# Altium schematic sheet EBI, GPIO.SchDoc
size 260 x 200 mm
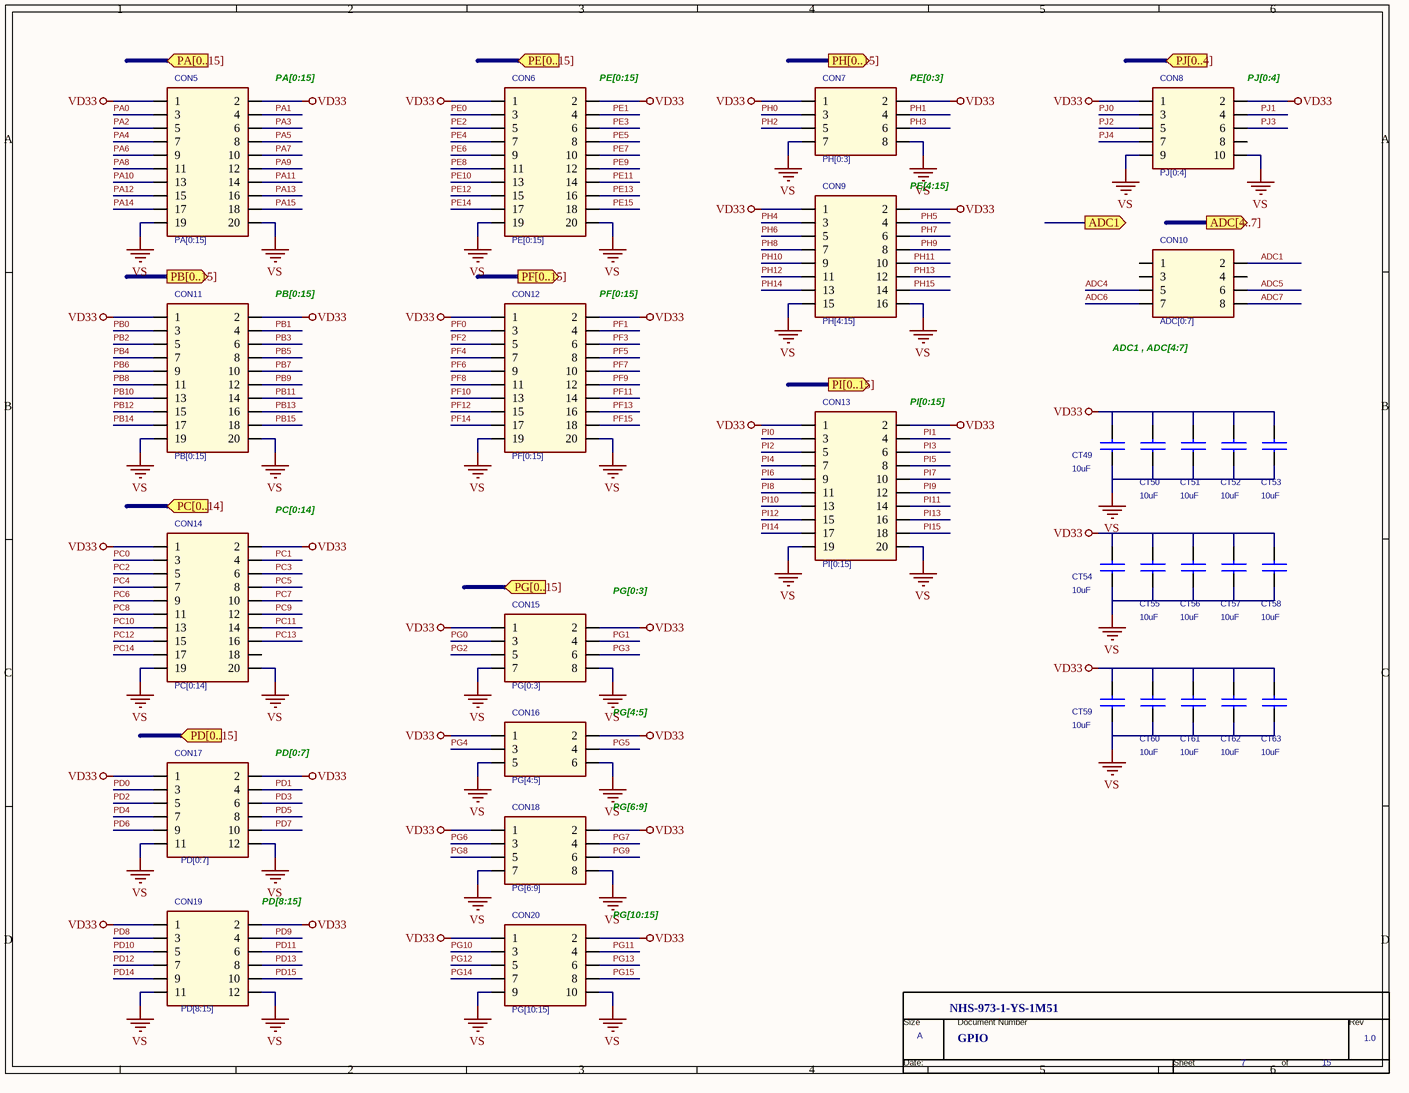
[diagram p0: EBI, GPIO.SchDoc]

## Parts
*  RevCode: 1.0  Page Size: A  Page Number: 7  Page Count: 15  Doc: GPIO  OrgName: NHS-973-1-YS-1M51  (hidden comment: TitleBlock0N)  (graphical)
CON5  PA[0:15]  [Header_2x10_2.54mm]
CON6  PE[0:15]  [Header_2x10_2.54mm]
CON7  PH[0:3]  [Header_2x4_2.54mm]
CON8  PJ[0:4]  [Header_2x5_2.54mm]
CON9  PH[4:15]  [header_2x8_2.54mm]
CON10  ADC[0:7]  [Header_2x4_2.54mm]
CON11  PB[0:15]  [Header_2x10_2.54mm]
CON12  PF[0:15]  [Header_2x10_2.54mm]
CON13  PI[0:15]  [Header_2x10_2.54mm]
CON14  PC[0:14]  [Header_2x10_2.54mm]
CON15  PG[0:3]  [Header_2x4_2.54mm]
CON16  PG[4:5]  [Header_2x3_2.54mm]
CON17  PD[0:7]  [Header_2x6_2.54mm]
CON18  PG[6:9]  [Header_2x4_2.54mm]
CON19  PD[8:15]  [Header_2x6_2.54mm]
CON20  PG[10:15]  [Header_2x5_2.54mm]
CT49  10uF  [C0603]
CT50  10uF  [C0603]
CT51  10uF  [C0603]
CT52  10uF  [C0603]
CT53  10uF  [C0603]
CT54  10uF  [C0603]
CT55  10uF  [C0603]
CT56  10uF  [C0603]
CT57  10uF  [C0603]
CT58  10uF  [C0603]
CT59  10uF  [C0603]
CT60  10uF  [C0603]
CT61  10uF  [C0603]
CT62  10uF  [C0603]
CT63  10uF  [C0603]

## Ports
ADC1 (out), ADC[4..7] (out), PA[0..15] (in), PB[0..15] (out), PC[0..14] (in), PD[0..15] (in), PE[0..15] (in), PF[0..15] (out), PG[0..15] (in), PH[0..15] (out), PI[0..15] (out), PJ[0..4] (in)

## Nets
VD33: CON5.1 CON5.2 CON6.1 CON6.2 CON7.1 CON7.2 CON8.1 CON8.2 CON9.1 CON9.2 CON11.1 CON11.2 CON12.1 CON12.2 CON13.1 CON13.2 CON14.1 CON14.2 CON15.1 CON15.2 CON16.1 CON16.2 CON17.1 CON17.2 CON18.1 CON18.2 CON19.1 CON19.2 CON20.1 CON20.2 CT49.2 CT50.2 CT51.2 CT52.2 CT53.2 CT54.2 CT55.2 CT56.2 CT57.2 CT58.2 CT59.2 CT60.2 CT61.2 CT62.2 CT63.2
VS: CON5.19 CON5.20 CON6.19 CON6.20 CON7.7 CON7.8 CON8.9 CON8.10 CON9.15 CON9.16 CON11.19 CON11.20 CON12.19 CON12.20 CON13.19 CON13.20 CON14.19 CON14.20 CON15.7 CON15.8 CON16.5 CON16.6 CON17.11 CON17.12 CON18.7 CON18.8 CON19.11 CON19.12 CON20.9 CON20.10 CT49.1 CT50.1 CT51.1 CT52.1 CT53.1 CT54.1 CT55.1 CT56.1 CT57.1 CT58.1 CT59.1 CT60.1 CT61.1 CT62.1 CT63.1
ADC1: CON10.2
ADC4: CON10.5
ADC5: CON10.6
ADC6: CON10.7
ADC7: CON10.8
PA0: CON5.3
PA1: CON5.4
PA2: CON5.5
PA3: CON5.6
PA4: CON5.7
PA5: CON5.8
PA6: CON5.9
PA7: CON5.10
PA8: CON5.11
PA9: CON5.12
PA10: CON5.13
PA11: CON5.14
PA12: CON5.15
PA13: CON5.16
PA14: CON5.17
PA15: CON5.18
PB0: CON11.3
PB1: CON11.4
PB2: CON11.5
PB3: CON11.6
PB4: CON11.7
PB5: CON11.8
PB6: CON11.9
PB7: CON11.10
PB8: CON11.11
PB9: CON11.12
PB10: CON11.13
PB11: CON11.14
PB12: CON11.15
PB13: CON11.16
PB14: CON11.17
PB15: CON11.18
PC0: CON14.3
PC1: CON14.4
PC2: CON14.5
PC3: CON14.6
PC4: CON14.7
PC5: CON14.8
PC6: CON14.9
PC7: CON14.10
PC8: CON14.11
PC9: CON14.12
PC10: CON14.13
PC11: CON14.14
PC12: CON14.15
PC13: CON14.16
PC14: CON14.17
PD0: CON17.3
PD1: CON17.4
PD2: CON17.5
PD3: CON17.6
PD4: CON17.7
PD5: CON17.8
PD6: CON17.9
PD7: CON17.10
PD8: CON19.3
PD9: CON19.4
PD10: CON19.5
PD11: CON19.6
PD12: CON19.7
PD13: CON19.8
PD14: CON19.9
PD15: CON19.10
PE0: CON6.3
PE1: CON6.4
PE2: CON6.5
PE3: CON6.6
PE4: CON6.7
PE5: CON6.8
PE6: CON6.9
PE7: CON6.10
PE8: CON6.11
PE9: CON6.12
PE10: CON6.13
PE11: CON6.14
PE12: CON6.15
PE13: CON6.16
PE14: CON6.17
PE15: CON6.18
PF0: CON12.3
PF1: CON12.4
PF2: CON12.5
PF3: CON12.6
PF4: CON12.7
PF5: CON12.8
PF6: CON12.9
PF7: CON12.10
PF8: CON12.11
PF9: CON12.12
PF10: CON12.13
PF11: CON12.14
PF12: CON12.15
PF13: CON12.16
PF14: CON12.17
PF15: CON12.18
PG0: CON15.3
PG1: CON15.4
PG2: CON15.5
PG3: CON15.6
PG4: CON16.3
PG5: CON16.4
PG6: CON18.3
PG7: CON18.4
PG8: CON18.5
PG9: CON18.6
PG10: CON20.3
PG11: CON20.4
PG12: CON20.5
PG13: CON20.6
PG14: CON20.7
PG15: CON20.8
PH0: CON7.3
PH1: CON7.4
PH2: CON7.5
PH3: CON7.6
PH4: CON9.3
PH5: CON9.4
PH6: CON9.5
PH7: CON9.6
PH8: CON9.7
PH9: CON9.8
PH10: CON9.9
PH11: CON9.10
PH12: CON9.11
PH13: CON9.12
PH14: CON9.13
PH15: CON9.14
PI0: CON13.3
PI1: CON13.4
PI2: CON13.5
PI3: CON13.6
PI4: CON13.7
PI5: CON13.8
PI6: CON13.9
PI7: CON13.10
PI8: CON13.11
PI9: CON13.12
PI10: CON13.13
PI11: CON13.14
PI12: CON13.15
PI13: CON13.16
PI14: CON13.17
PI15: CON13.18
PJ0: CON8.3
PJ1: CON8.4
PJ2: CON8.5
PJ3: CON8.6
PJ4: CON8.7

Not connected (* = marked no-connect by the designer): CON8 8; CON10 1 3 4; CON14 18

## Notes on the sheet
- (near CON5) PA[0:15]
- (near CON6) PE[0:15]
- (near CON7) PE[0:3]
- (near CON8) PJ[0:4]
- (near CON9) PE[4:15]
- (near CON11) PB[0:15]
- (near CON12) PF[0:15]
- (near CON10) ADC1 , ADC[4:7]
- (near CON13) PI[0:15]
- (near CON14) PC[0:14]
- (near CON15) PG[0:3]
- (near CON17) PD[0:7]
- PG[4:5]
- PG[6:9]
- (near CON19) PD[8:15]
- PG[10:15]
- (in symbol TitleBlock0N) Size; Document Number; Rev; Date:; Sheet; of

## Library data of the parts
CON5 CON6 CON11-CON14 = CON20A
CON7 CON10 = CON8A
CON8 = CON10A
CON9 = CON16A
CON15 = CON8A_2
CON16 = CON6A_1
CON17 CON19 = CON12A
CON18 = CON8A_3
CON20 = CON10A_1
CT49-CT63 = CAP NP
* = TitleBlock0N: Page Create Date: April 25, 1995